# Altium schematic sheet SPI Flash.SchDoc
size A; SheetNumber: 4; SheetTotal: 7
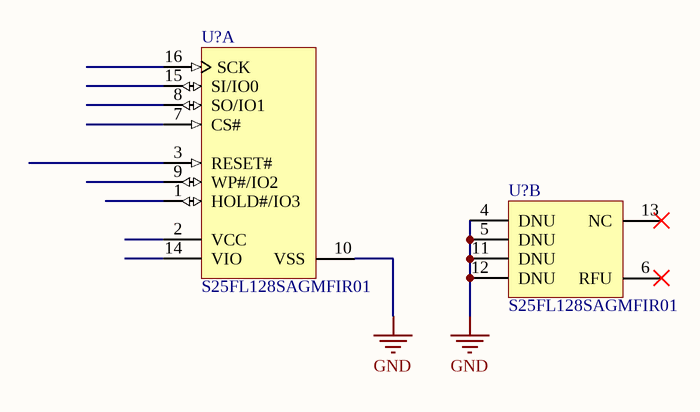
[diagram p0: SPI Flash.SchDoc]

## Parts
(Parts that share a designator on the sheet are numbered #1, #2 ... from top to bottom, then left to right.)
U?#1  S25FL128SAGMFIR01  [SPSN-SOIC-16_N]  (part A of 2)
U?#2  S25FL128SAGMFIR01  [SPSN-SOIC-16_N]  (part B of 2)

## Nets
GND: U?#1.10(VSS) U?#2.4(DNU) U?#2.5(DNU) U?#2.11(DNU) U?#2.12(DNU)

Not connected (* = marked no-connect by the designer): U?#1 1(HOLD#/IO3) 2(VCC) 3(RESET#) 7(CS#) 8(SO/IO1) 9(WP#/IO2) 14(VIO) 15(SI/IO0) 16(SCK); U?#2 6(RFU)* 13(NC)*

## Library data of the parts
U?#1 U?#2 = CMP-1329-00021-1: MirrorBit Flash Non-Volatile Memory CMOS 3.0 Volt Core with Versatile I/O, Serial Peripheral Interface with Multi-I/O, 128 Mbit, 133 MHz, -40 to 85 degC, 16-Pin SO (SO3016), RoHS, Tube; Manufacturer: Spansion; OTP: 1024 B; VCC: 2.7 to 3.6 V; Speed: 133 MHz; PackageDescription: 16-Pin Wide Plastic Small Outline Package, Body 10.3 x 7.5 mm, Pitch 1.27 mm; ComponentLink2URL: http://www.spansion.com/Support/Datasheets/S25FL128S_256S_00.pdf; PartNumber: S25FL128SAGMFIR01; Packing: Tube; Density: 128 Mbit; Temperature Range: -40 to 85 degC; Mounting Technology: Surface Mount; RoHS: TRUE; DatasheetVersion: Rev. 08; ComponentLink2Description: Datasheet; ComponentLink3URL: http://www.spansion.com/Support/Datasheets/S25FL128S_256S_00.pdf; ComponentLink1Description: Manufacturer URL; ComponentLink1URL: http://www.spansion.com/Pages/Default.aspx; ComponentLink3Description: Package Specification